# Altium schematic sheet [04] - Bluetooth.SchDoc
size A4
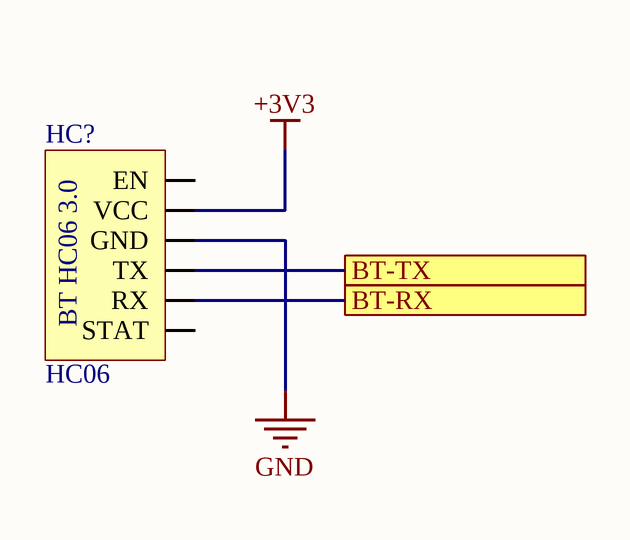
[diagram p0: [04] - Bluetooth.SchDoc]

## Parts
HC?  HC06  [HC06]

## Ports
BT-RX, BT-TX

## Nets
+3V3: HC?.5(VCC)
GND: HC?.4(GND)
BT-RX: HC?.2(RX) ; port BT-RX
BT-TX: HC?.3(TX) ; port BT-TX

Not connected (* = marked no-connect by the designer): HC? 1(STAT) 6(EN)

## Notes on the sheet
- Title
- Size:
- Date:
- A4
- Number:
- Time:
- Revision:
- Sheet
- of
- File:
- (in symbol HC06) BT HC06 3.0

## Library data of the parts
HC? = HC06: Manufacturer: W¨¹rth Elektronik eiSos GmbH; partNo: 613004143121; ComponentLink1 Description: Manufacturer; ComponentLink2 Description: Datasheet; NoPins: 04; Created Date: 29 March 2013; ComponentLink1URL: http://www.we-online.com; ComponentLink2URL: http://katalog.we-online.de/em/datasheet/6130xx143121.pdf; Created by: Karrer Zheng